# EasyEDA schematic SCH_AP_tempboard_2024-01-17.json
TITLE: Sheet_1; REV: 1.0; Date: 2023-11-05; Sheet: 1/1; Drawn By: crw010284; Company: Your Company
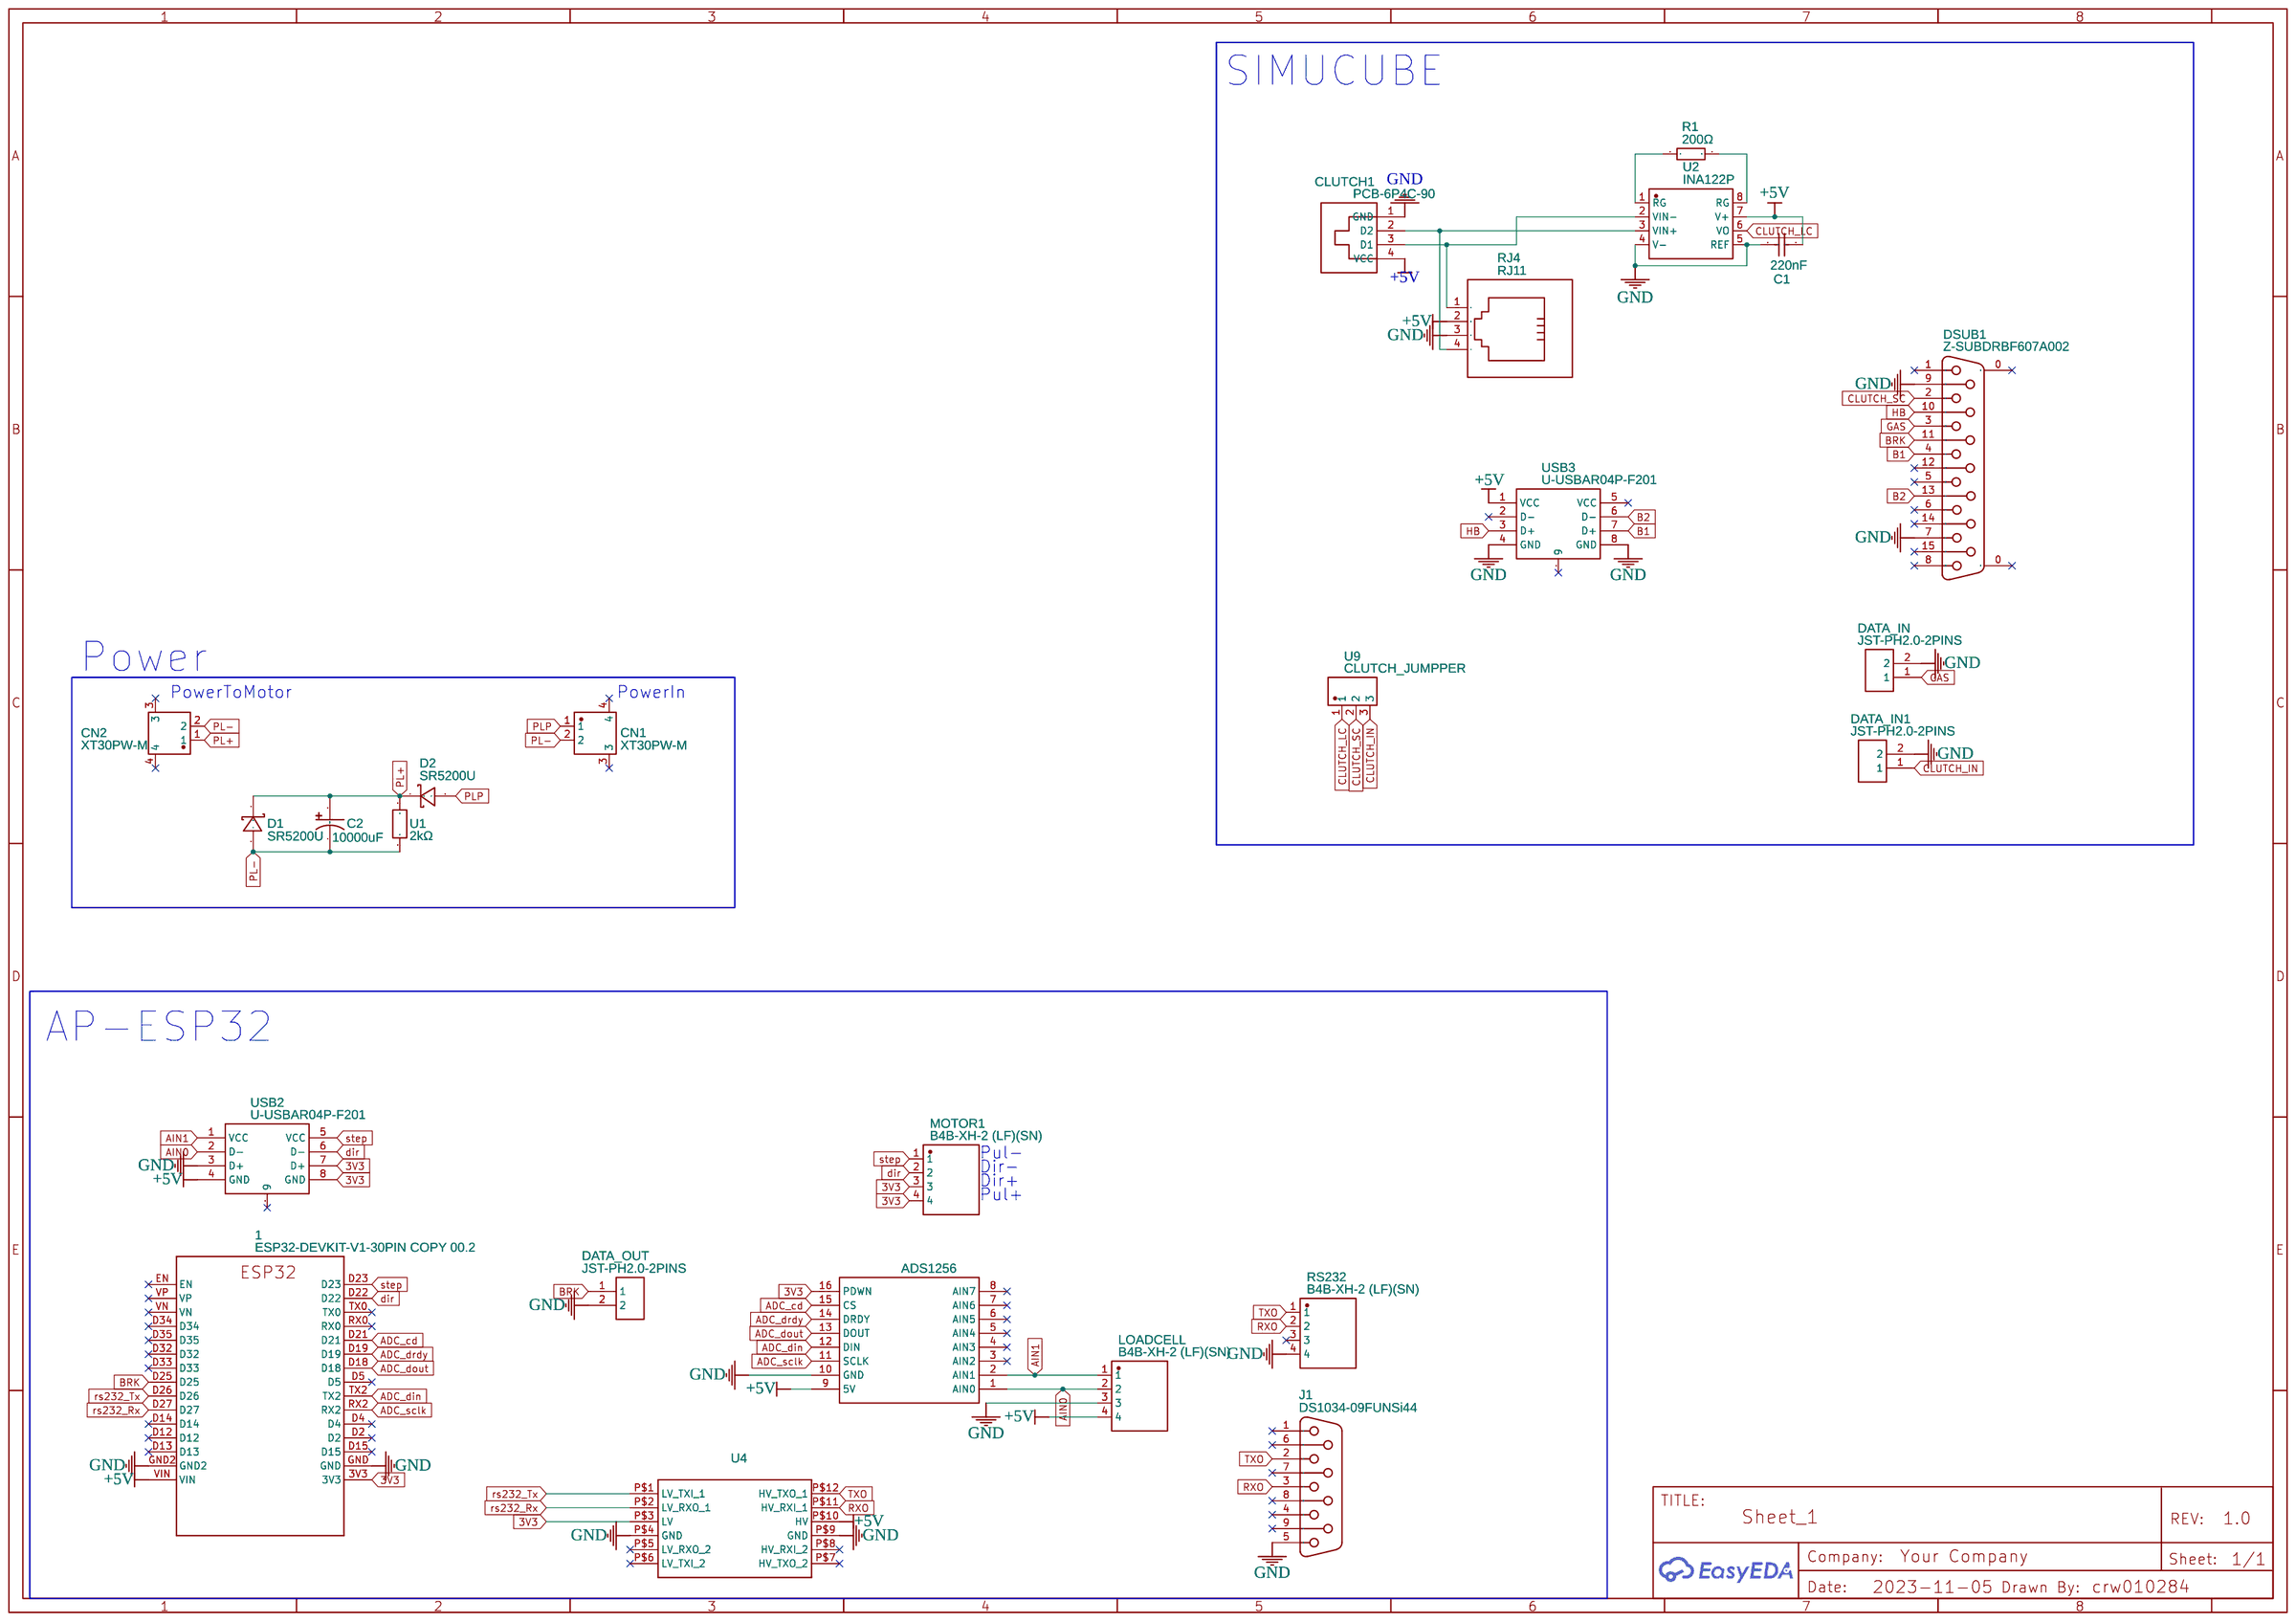
[diagram p0: schematic sheet]

## Parts
1  ESP32-DEVKIT-V1-30PIN COPY 00.2  [ESP32-DEVKITV1_ESP32-DEVKITV1]
C1  220nF  [C0603]
C2  10000uF  [CAP-TH_BD30.0-P10.00-D2.3-FD]
CLUTCH1  PCB-6P4C-90  [RJ11-TH_PCB-6P4C-90]
CN1  XT30PW-M  [CONN-TH_XT30PW-M]
CN2  XT30PW-M  [CONN-TH_XT30PW-M]
D1  SR5200U  [DO-201AD_BD5.3-L9.5-P13.50-D1.4-RD]
D2  SR5200U  [DO-201AD_BD5.3-L9.5-P13.50-D1.4-RD]
DATA_IN  JST-PH2.0-2PINS  [JST-PH2.0-2PINS]
DATA_IN1  JST-PH2.0-2PINS  [JST-PH2.0-2PINS]
DATA_OUT  JST-PH2.0-2PINS  [JST-PH2.0-2PINS]
DSUB1  Z-SUBDRBF607A002  [DSUB-TH_Z-SUBDRBF607A002]
J1  DS1034-09FUNSi44  [DSUB9-2]
LOADCELL  B4B-XH-2 (LF)(SN)  [CONN-TH_B4B-XH-2-LF-SN]
MOTOR1  B4B-XH-2 (LF)(SN)  [CONN-TH_B4B-XH-2-LF-SN]
R1  200Ω  [R0402]
RJ4  RJ11  [RJ11-TH_RJII-623K-4P4CGRAYBOUNDLESS]
RS232  B4B-XH-2 (LF)(SN)  [CONN-TH_B4B-XH-2-LF-SN]
U1  2kΩ  [RES-TH_BD8.5-L24.5-P28.5-D0.7]
U2  INA122P  [PDIP-8_L9.6-W6.4-P2.54-LS7.6-BL]
U3  ADS1256  [ADS1256]
U4  NO  [LOGIC_LEVEL_CONVERTER]
U9  CLUTCH_JUMPPER  [HDR-TH_3P-P2.54-V-M-A]
USB2  U-USBAR04P-F201  [USB-A-TH_U-USBAR04P-F201]
USB3  U-USBAR04P-F201  [USB-A-TH_U-USBAR04P-F201]

## Library data of the parts
1 = ESP32-DEVKIT-V1-30PIN: Contributor: u18040382
C1 = CL10B224KA8NNNC: Supplier: LCSC; Manufacturer: SAMSUNG(三星); Supplier Part: C21120; JLCPCB Part Class: Basic Part
C2 = HL103M063O510A: Contributor: LCSC; Supplier: LCSC; Supplier Part: C402631; Manufacturer: CapXon(丰宾); JLCPCB Part Class: Extended Part; link: https://lcsc.com/eda_search?q=C402631&%26type=1&ref=editor
CLUTCH1 = PCB-6P4C-90: Supplier: LCSC; Supplier Part: C189749; Manufacturer: Ckmtw(灿科盟); Manufacturer Part: R-RJ11R04P-A800; Contributor: LCSC; JLCPCB Part Class: Extended Part
CN1 CN2 = XT30PW-M: Contributor: LCSC; Supplier: LCSC; Supplier Part: C431092; Manufacturer: AMASS(艾迈斯); JLCPCB Part Class: Extended Part; link: https://lcsc.com/eda_search?q=C431092&%26type=1&ref=editor
D1 D2 = SR5200U: Contributor: lcsc; Supplier: LCSC; Supplier Part: C2929627; Manufacturer: 迪一; link: https://lcsc.com/eda_search?q=C2929627&%26type=1&ref=editor
DATA_IN DATA_IN1 DATA_OUT = JST-PH2.0-2PINS: Contributor: alieksieiev.yurii
DSUB1 = Z-SUBDRBF607A002: Supplier: LCSC; Supplier Part: C235817; Manufacturer: Nextron(台湾正凌); Contributor: LCSC; JLCPCB Part Class: Extended Part
J1 = DS1034-09FUNSi44: Supplier Part: C77831; Supplier: LCSC; Manufacturer: CONNFLY; LCSC Assembly: Yes; SMT Type: Extend; JLCPCB Part Class: Extended Part; Contributor: aqadron
LOADCELL MOTOR1 RS232 = B4B-XH-2 (LF)(SN): Contributor: LCSC; Supplier: LCSC; Supplier Part: C157999; Manufacturer: JST; Manufacturer Part: B4B-XH-2(LF)(SN); JLCPCB Part Class: Extended Part; link: https://lcsc.com/eda_search?q=C157999&%26type=1&ref=editor
R1 = 0402WGF2000TCE: Supplier: LCSC; Manufacturer: UNI-ROYAL(厚声); Supplier Part: C25087; JLCPCB Part Class: Basic Part; link: https://lcsc.com/eda_search?q=C25087&%26type=1&ref=editor
RJ4 = RJII-623K-4P4CGray boundless: Supplier: LCSC; Manufacturer: ReliaPro; Supplier Part: C55377; link: https://lcsc.com/eda_search?q=C55377&%26type=1&ref=editor
U1 = RSF5WSJB-91-2K: Contributor: lcsc; Supplier: LCSC; Supplier Part: C1400982; Manufacturer: YAGEO(国巨); JLCPCB Part Class: Extended Part; link: https://lcsc.com/eda_search?q=C1400982&%26type=1&ref=editor
U2 = INA122P: Supplier: LCSC; Supplier Part: C1346816; Manufacturer: TI(德州仪器); Contributor: LCSC; JLCPCB Part Class: Extended Part
U3 = ADS1256: link: https://www.amazon.es/DollaTek-ADS1256-8channel-precisi%C3%B3n-adquisici%C3%B3n/dp/B07DK5GC9H/ref=sr_1_1?__mk_es_ES=%C3%85M%C3%85%C5%BD%C3%95%C3%91&dchild=1&keywords=ADS1256&qid=1588184343&sr=8-1; Contributor: jesdefer
U4 = LOGIC_LEVEL_CONVERTER: Logic Level Converter (3.3v - 5v); Contributor: SparkFun
U9 = JUMPER3: Contributor: LCSC; Supplier: LCSC; Supplier Part: C2940050; Manufacturer: null; Manufacturer Part: Jumper3; JLCPCB Part Class: Extended Part
USB2 USB3 = U-USBAR04P-F201: Supplier: LCSC; Supplier Part: C386741; Manufacturer: Ckmtw(灿科盟); Contributor: LCSC; JLCPCB Part Class: Extended Part

## Nets
3V3: 1.3V3 MOTOR1.3 MOTOR1.4 U3.16(PDWN) U4.P$3(LV) USB2.7(D+) USB2.8(GND)
+5V: 1.VIN C1.2 CLUTCH1.4(VCC) LOADCELL.4 RJ4.2 U2.7(V+) U3.9(5V) U4.P$10(HV) USB2.4(GND) USB3.1(VCC)
GND: 1.GND 1.GND2 C1.1 CLUTCH1.1(GND) DATA_IN.2 DATA_IN1.2 DATA_OUT.2 DSUB1.7 DSUB1.9 J1.5 LOADCELL.3 RJ4.3 RS232.4 U2.4(V-) U2.5(REF) U3.10(GND) U4.P$4(GND) U4.P$9(GND) USB2.3(D+) USB3.4(GND) USB3.8(GND)
ADC_cd: 1.D21 U3.15(CS)
ADC_din: 1.TX2 U3.12(DIN)
ADC_dout: 1.D18 U3.13(DOUT)
ADC_drdy: 1.D19 U3.14(DRDY)
ADC_sclk: 1.RX2 U3.11(SCLK)
AIN0: LOADCELL.2 U3.1(AIN0) USB2.2(D-)
AIN1: LOADCELL.1 U3.2(AIN1) USB2.1(VCC)
B1: DSUB1.4 USB3.7(D+)
B2: DSUB1.13 USB3.6(D-)
BRK: 1.D25 DATA_OUT.1 DSUB1.11
CLUTCH_IN: DATA_IN1.1 U9.3
CLUTCH_LC: U2.6(VO) U9.1
CLUTCH_SC: DSUB1.2 U9.2
dir: 1.D22 MOTOR1.2 USB2.6(D-)
GAS: DATA_IN.1 DSUB1.3
HB: DSUB1.10 USB3.3(D+)
PL+: C2.1 CN2.1 D1.1(C) D2.1(C) U1.1
PL-: C2.2 CN1.2 CN2.2 D1.2(A) U1.2
PLP: CN1.1 D2.2(A)
rs232_Rx: 1.D27 U4.P$2(LV_RXO_1)
rs232_Tx: 1.D26 U4.P$1(LV_TXI_1)
RXO: J1.3 RS232.2 U4.P$11(HV_RXI_1)
step: 1.D23 MOTOR1.1 USB2.5(VCC)
TXO: J1.2 RS232.1 U4.P$12(HV_TXO_1)
Net-(CLUTCH1-2): CLUTCH1.2(D2) RJ4.4 U2.3(VIN+)
Net-(CLUTCH1-3): CLUTCH1.3(D1) RJ4.1 U2.2(VIN-)
Net-(R1-1): R1.1 U2.1(RG)
Net-(R1-2): R1.2 U2.8(RG)

Not connected (* = marked no-connect by the designer): 1 D2* D4* D5* D12* D13* D14* D15* D32* D33* D34* D35* EN* RX0* TX0* VN* VP*; CN1 3* 4*; CN2 3* 4*; DSUB1 0(MH2)* 1* 5* 6* 8* 12* 14* 15*; J1 1* 4* 6* 7* 8* 9*; RS232 3*; U3 3(AIN2)* 4(AIN3)* 5(AIN4)* 6(AIN5)* 7(AIN6)* 8(AIN7)*; U4 P$5(LV_RXO_2)* P$6(LV_TXI_2)* P$7(HV_TXO_2)* P$8(HV_RXI_2)*; USB2 9*; USB3 2(D-)* 5(VCC)* 9*

## Notes on the sheet
- SIMUCUBE
- Power
- PowerToMotor
- PowerIn
- AP-ESP32
- Pul-
- Dir-
- Dir+
- Pul+
